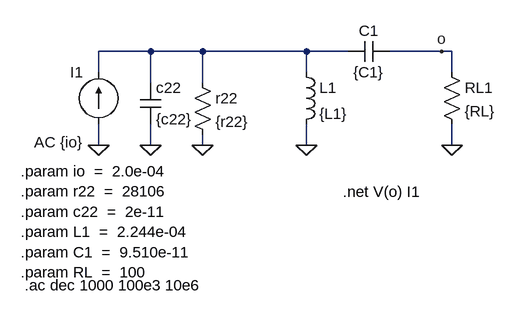
[diagram p0: schematic eje2_resuelto.asc]
eje2_resuelto.asc, the LTspice schematic file:
Version 4
SHEET 1 880 680
WIRE -304 64 -384 64
WIRE -224 64 -304 64
WIRE -64 64 -224 64
WIRE 0 64 -64 64
WIRE 144 64 64 64
WIRE 160 64 144 64
WIRE -384 96 -384 64
WIRE -64 96 -64 64
WIRE 160 96 160 64
WIRE -304 112 -304 64
WIRE -224 112 -224 64
WIRE -384 208 -384 176
WIRE -304 208 -304 176
WIRE -224 208 -224 192
WIRE -64 208 -64 176
WIRE 160 208 160 176
FLAG -64 208 0
FLAG 160 208 0
FLAG -224 208 0
FLAG -304 208 0
FLAG -384 208 0
FLAG 144 64 o
SYMBOL ind -80 80 R0
SYMATTR InstName L1
SYMATTR Value {L1}
SYMBOL cap 0 80 R270
WINDOW 0 32 32 VTop 2
WINDOW 3 0 32 VBottom 2
SYMATTR InstName C1
SYMATTR Value {C1}
SYMBOL res 144 80 R0
SYMATTR InstName RL1
SYMATTR Value {RL}
SYMBOL cap -320 112 R0
SYMATTR InstName c22
SYMATTR Value {c22}
SYMBOL current -384 176 R180
WINDOW 0 24 80 Left 2
WINDOW 3 24 0 Left 2
WINDOW 123 24 -28 Left 2
WINDOW 39 0 0 Left 0
SYMATTR InstName I1
SYMATTR Value ""
SYMATTR Value2 AC {io}
SYMBOL res -240 96 R0
SYMATTR InstName r22
SYMATTR Value {r22}
TEXT -498 424 Left 2 !.ac dec 1000 100e3 10e6
TEXT -8 280 Left 2 !.net V(o) I1
TEXT -504 248 Left 2 !.param io  =  2.0e-04 \n.param r22  =  28106 \n.param c22  =  2e-11 \n.param L1  =  2.244e-04\n.param C1  =  9.510e-11\n.param RL  =  100

The netlist it stands for:
* eje2_resuelto.asc
L1 N001 0 {L1}
C1 N001 o {C1}
RL1 o 0 {RL}
c22 N001 0 {c22}
I1 0 N001 AC {io}
r22 N001 0 {r22}
.ac dec 1000 100e3 10e6
.net V(o) I1
.param io  =  2.0e-04
.param r22  =  28106
.param c22  =  2e-11
.param L1  =  2.244e-04
.param C1  =  9.510e-11
.param RL  =  100
.backanno
.end